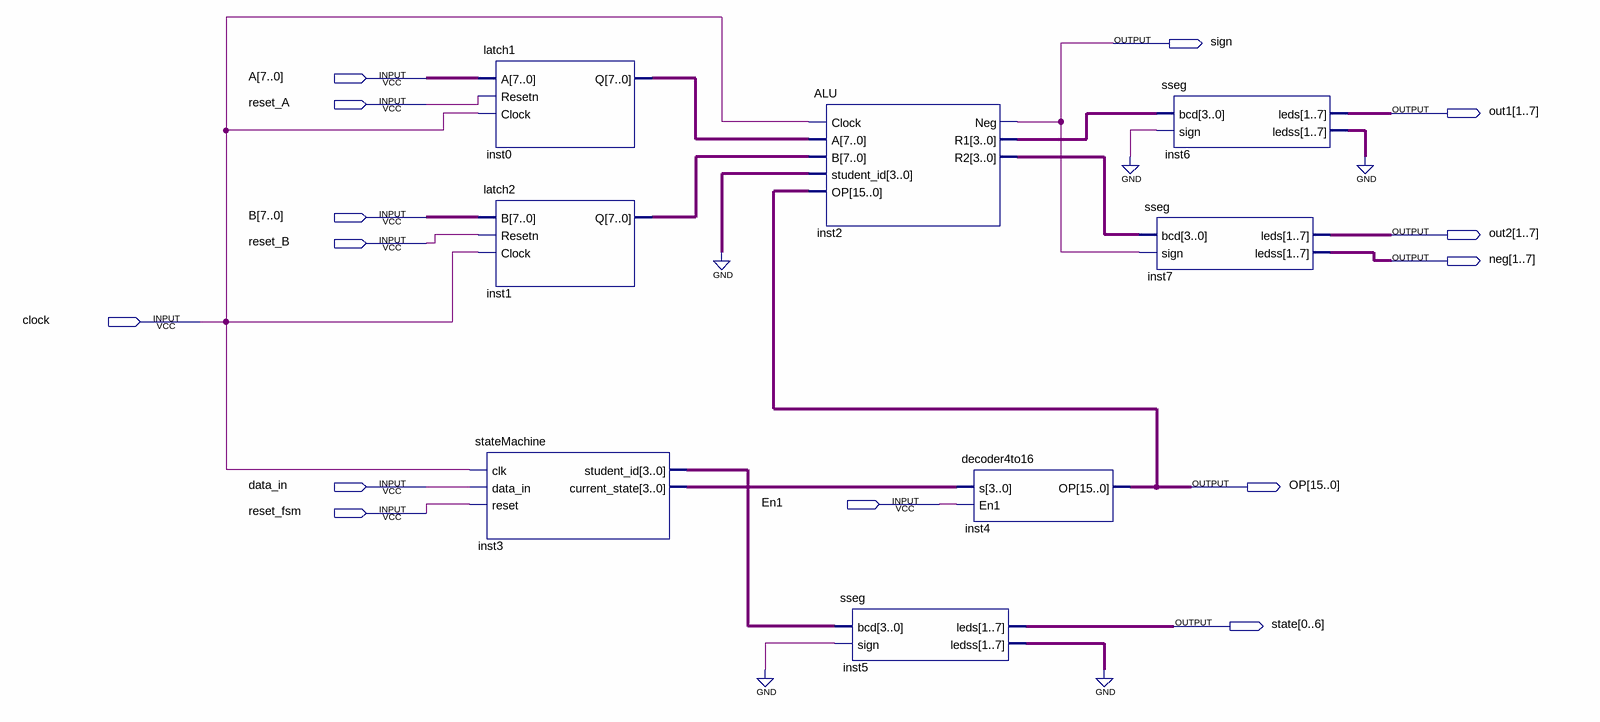
[diagram p0: schematic sheet]
// Quartus schematic lab6_diagram.bdf as structural Verilog: 8 symbols, 14 pins
module lab6_diagram (
  input  [7:0] A,
  input  reset_A,
  input  [7:0] B,
  input  reset_B,
  input  clock,
  input  data_in,
  input  En1,
  input  reset_fsm,
  output sign,
  output [1:7] out1,
  output [1:7] out2,
  output [1:7] neg,
  output [15:0] OP,
  output [0:6] state
);

  wire [3:0] inst2_r1, inst2_r2, inst3_current_state, inst3_student_id;
  wire [6:0] inst5_ledss, inst6_ledss;
  wire [7:0] inst0_q, inst1_q;

  stateMachine inst3 (
    .clk(clock), .data_in(data_in), .reset(reset_fsm), .student_id(inst3_student_id),
    .current_state(inst3_current_state));
  latch1 inst0 (.A(A), .Resetn(reset_A), .Clock(clock), .Q(inst0_q));
  latch2 inst1 (.B(B), .Resetn(reset_B), .Clock(clock), .Q(inst1_q));
  ALU inst2 (
    .Clock(clock), .A(inst0_q), .B(inst1_q), .student_id(4'b0000), .OP(OP), .Neg(sign), .R1(inst2_r1),
    .R2(inst2_r2));
  sseg inst5 (.bcd(inst3_student_id), .sign(1'b0), .leds(state), .ledss(inst5_ledss));
  decoder4to16 inst4 (.s(inst3_current_state), .En1(En1), .OP(OP));
  sseg inst6 (.bcd(inst2_r1), .sign(1'b0), .leds(out1), .ledss(inst6_ledss));
  sseg inst7 (.bcd(inst2_r2), .sign(sign), .leds(out2), .ledss(neg));
  // also tied to GND on the sheet: {inst6_ledss[0], inst6_ledss[1], inst6_ledss[2], inst6_ledss[3], inst6_ledss[4], inst6_ledss[5], inst6_ledss[6], inst5_ledss[0], inst5_ledss[1], inst5_ledss[2], inst5_ledss[3], inst5_ledss[4], inst5_ledss[5], inst5_ledss[6]}
endmodule
